# Altium project IFE_PDB_2019.PrjPCB
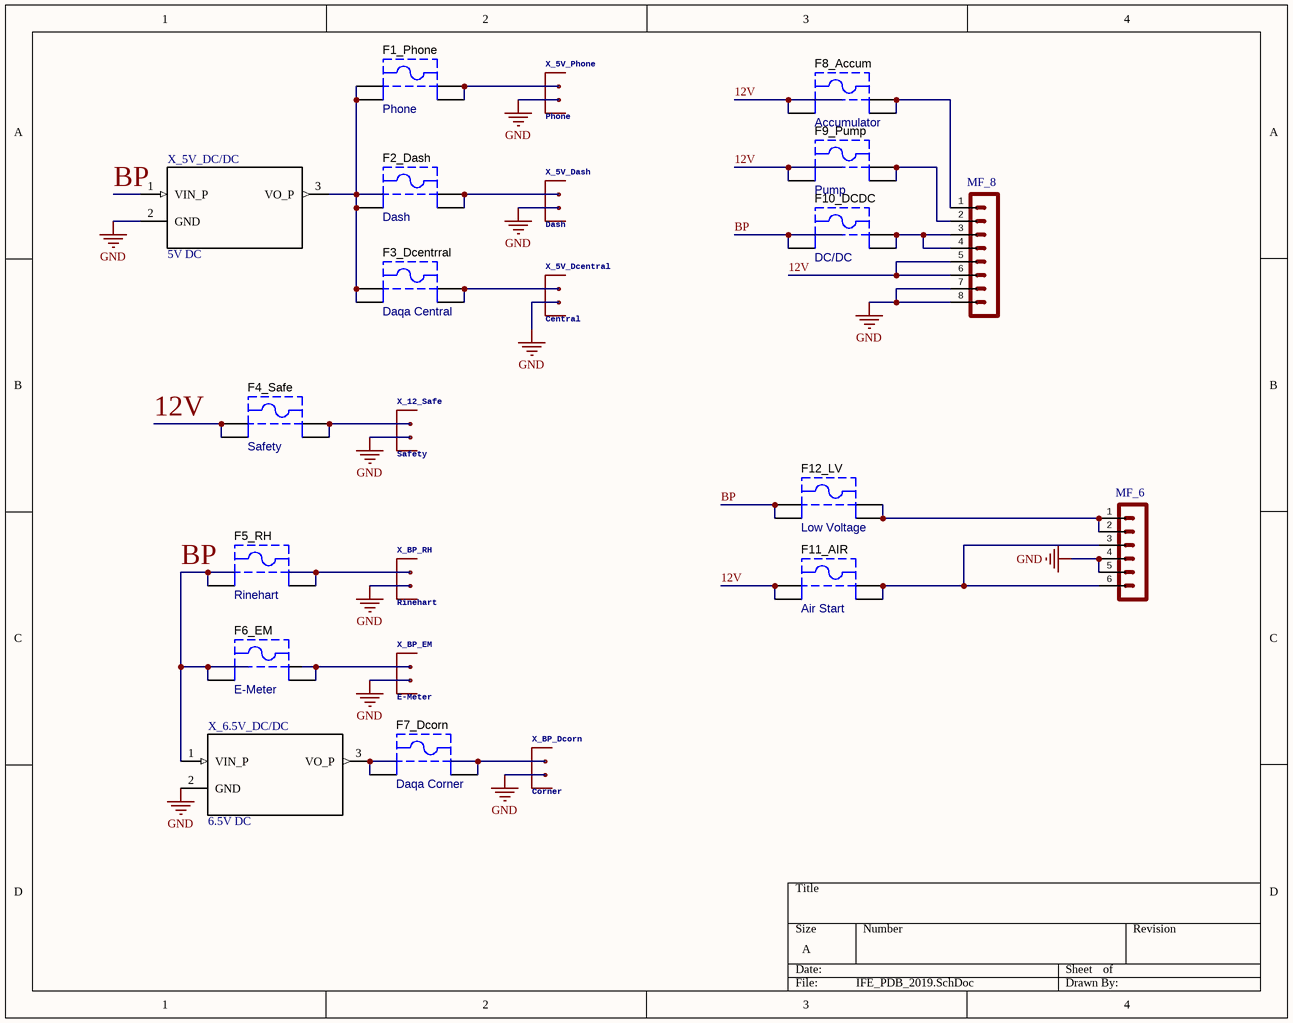
[diagram p0: IFE_PDB_2019.SchDoc]
1 sheet, 23 parts. Net scope: global (net labels, ports and power ports of the same name join across sheets).
Board file: IFE_PDB_2019.PcbDoc

## Sheet IFE_PDB_2019.SchDoc
size A

### Parts
F1_Phone  Phone  [KSTN-3568_V]
F2_Dash  Dash  [KSTN-3568_V]
F3_Dcentrral  Daqa Central  [KSTN-3568_V]
F4_Safe  Safety  [KSTN-3568_V]
F5_RH  Rinehart  [KSTN-3568_V]
F6_EM  E-Meter  [KSTN-3568_V]
F7_Dcorn  Daqa Corner  [KSTN-3568_V]
F8_Accum  Accumulator  [KSTN-3568_V]
F9_Pump  Pump  [KSTN-3568_V]
F10_DCDC  DC/DC  [KSTN-3568_V]
F11_AIR  Air Start  [KSTN-3568_V]
F12_LV  Low Voltage  [KSTN-3568_V]
MF_6  (no value)  [172065-0306]
MF_8  (no value)  [172065-0308]
X_5V_Dash  Dash  [505575-02]
X_5V_DC/DC  5V DC  [*CONV_V7805-2000]
X_5V_Dcentral  Central  [505575-02]
X_5V_Phone  Phone  [505575-02]
X_6.5V_DC/DC  6.5V DC  [*CONV_V7805-2000]
X_12_Safe  Safety  [505575-02]
X_BP_Dcorn  Corner  [505575-02]
X_BP_EM  E-Meter  [505575-02]
X_BP_RH  Rinehart  [505575-02]

### Nets
GND: MF_6.4 MF_6.5 MF_8.7 MF_8.8 X_5V_Dash.2 X_5V_DC/DC.2(GND) X_5V_Dcentral.2 X_5V_Phone.2 X_6.5V_DC/DC.2(GND) X_12_Safe.2 X_BP_Dcorn.2 X_BP_EM.2 X_BP_RH.2
12V: F4_Safe.1 F4_Safe.2 F8_Accum.1 F8_Accum.2 F9_Pump.1 F9_Pump.2 F11_AIR.1 F11_AIR.2 MF_8.5 MF_8.6
BP: F5_RH.1 F5_RH.2 F6_EM.1 F6_EM.2 F10_DCDC.1 F10_DCDC.2 F12_LV.1 F12_LV.2 X_5V_DC/DC.1(VIN_P) X_6.5V_DC/DC.1(VIN_P)
NetF1_Phone_1: F1_Phone.1 F1_Phone.2 F2_Dash.1 F2_Dash.2 F3_Dcentrral.1 F3_Dcentrral.2 X_5V_DC/DC.3(VO_P)
NetF1_Phone_3: F1_Phone.3 F1_Phone.4 X_5V_Phone.1
NetF2_Dash_3: F2_Dash.3 F2_Dash.4 X_5V_Dash.1
NetF3_Dcentrral_3: F3_Dcentrral.3 F3_Dcentrral.4 X_5V_Dcentral.1
NetF4_Safe_3: F4_Safe.3 F4_Safe.4 X_12_Safe.1
NetF5_RH_3: F5_RH.3 F5_RH.4 X_BP_RH.1
NetF6_EM_3: F6_EM.3 F6_EM.4 X_BP_EM.1
NetF7_Dcorn_1: F7_Dcorn.1 F7_Dcorn.2 X_6.5V_DC/DC.3(VO_P)
NetF7_Dcorn_3: F7_Dcorn.3 F7_Dcorn.4 X_BP_Dcorn.1
NetF8_Accum_3: F8_Accum.3 F8_Accum.4 MF_8.1
NetF9_Pump_3: F9_Pump.3 F9_Pump.4 MF_8.2
NetF10_DCDC_3: F10_DCDC.3 F10_DCDC.4 MF_8.3 MF_8.4
NetF11_AIR_3: F11_AIR.3 F11_AIR.4 MF_6.3 MF_6.6
NetF12_LV_3: F12_LV.3 F12_LV.4 MF_6.1 MF_6.2

### Library data of the parts
F1_Phone F2_Dash F3_Dcentrral F4_Safe F5_RH F6_EM F7_Dcorn F8_Accum F9_Pump F10_DCDC F11_AIR F12_LV = CMP-2000-05464-1: Fuse Holder, 20 A, 500 V, -50 to 145 degC, 4-Pin THD, RoHS; Manufacturer: Keystone; Package Reference: 3568; Datasheet Version: 04/2013; Datasheet URL: https://datasheet.ciiva.com/16294/m60-2p40-16294706.pdf; Manufacturer URL: http://www.keyelco.com/; Mounting Technology: ThroughHole; Package Description: 4-Pin Through Hole Device, Body 16 x 6.73 mm, Pitch 9.9 mm
MF_6 = POS6_MgF172065-0306: Conn Power HDR 6 POS 5.7mm Solder ST Thru-Hole 6 Terminal 1 Port Mega-Fit® Frame : POS6_MgF172065-0306; Manufacturer: Molex; Supplier 1: Digikey; Manufacturer Part Number: 172065-0306; Stock 1: 426; Pricing 1: 1 = 7.66000, 89 = 6.38225, 178 = 6.06309, 534 = 5.10577, 1068 = 4.46754 (USD); ComponentLink1URL: http://datasheet.octopart.com/172065-0306-Molex-datasheet-101610458.pdf?src-supplier=Farnell; ComponentLink1Description: http://datasheet.octopart.com/172065-0306-Molex-datasheet-101610458.pdf?src-supplier=Farnell; ComponentLink2URL: http://datasheet.octopart.com/172065-0306-Molex-datasheet-96710945.pdf?src-supplier=Farnell; ComponentLink2Description: http://datasheet.octopart.com/172065-0306-Molex-datasheet-96710945.pdf?src-supplier=Farnell
MF_8 = POS8_MgF172065-0308: Conn Power HDR 8 POS 5.7mm Solder ST Thru-Hole 8 Terminal 1 Port Mega-Fit® Frame; Manufacturer: Molex; Supplier 1: Digikey; Manufacturer Part Number: 172065-0308; Stock 1: 323; Pricing 1: 1 = 9.17000, 68 = 7.57265, 136 = 7.37338, 544 = 6.17768, 1020 = 5.46027 (USD); ComponentLink1URL: http://datasheet.octopart.com/172065-0308-Molex-datasheet-101610459.pdf?src-supplier=Farnell; ComponentLink1Description: http://datasheet.octopart.com/172065-0308-Molex-datasheet-101610459.pdf?src-supplier=Farnell; ComponentLink2URL: http://datasheet.octopart.com/172065-0308-Molex-datasheet-96710946.pdf?src-supplier=Farnell; ComponentLink2Description: http://datasheet.octopart.com/172065-0308-Molex-datasheet-96710946.pdf?src-supplier=Farnell
X_5V_Dash X_5V_Dcentral X_12_Safe X_BP_Dcorn X_BP_EM X_BP_RH = 505575-02: Molex 505575-02 2 Position 2.00mm pitch connector wire to board connector Datasheet; GateName_1: G$1; SymbolName_1: 2POS; LibraryName: MOLEX Micro-Lock; DeviceSetName: 505575-02; Package: 505575-02
X_5V_DC/DC = V7805-2000: V78-2000 Series 13 W Single Output 12V Straight Non Isolated Switching Regulator; MF: CUI Inc.; MP: V7805-2000; SnapEDA_Link: https://www.snapeda.com/parts/V7805-2000/CUI%20Inc./view-part/?ref=snap; Package: SIP-3 CUI; Digi-Key_Part_Number: 102-2175-ND; CUI_purchase_URL: https://www.cui.com/product/power/dc-dc-converters/non-isolated/2-a-output-current/v78-2000-series?utm_source=snapeda.com&utm_medium=referral&utm_campaign=snapedaBOM; Digi-Key_Purchase_URL: https://www.digikey.com/product-detail/en/cui-inc/V7805-2000/102-2175-ND/2352134?utm_source=snapeda&utm_medium=aggregator&utm_campaign=symbol; Value: *
X_5V_Phone = 505575-02: GateName_1: G$1; SymbolName_1: 2POS; LibraryName: MOLEX Micro-Lock; DeviceSetName: 505575-02; Package: 505575-02
X_6.5V_DC/DC = V7805-2000: Male Header, Pitch 2.54 mm, 1 x 3 Position, Height 8.38 mm, Tail Length 3.18 mm, RoHS, Bulk; MF: CUI Inc.; MP: V7805-2000; SnapEDA_Link: https://www.snapeda.com/parts/V7805-2000/CUI%20Inc./view-part/?ref=snap; Package: SIP-3 CUI; Digi-Key_Part_Number: 102-2175-ND; CUI_purchase_URL: https://www.cui.com/product/power/dc-dc-converters/non-isolated/2-a-output-current/v78-2000-series?utm_source=snapeda.com&utm_medium=referral&utm_campaign=snapedaBOM; Digi-Key_Purchase_URL: https://www.digikey.com/product-detail/en/cui-inc/V7805-2000/102-2175-ND/2352134?utm_source=snapeda&utm_medium=aggregator&utm_campaign=symbol; Value: *